# Altium schematic sheet Sheet2.SchDoc
size A4
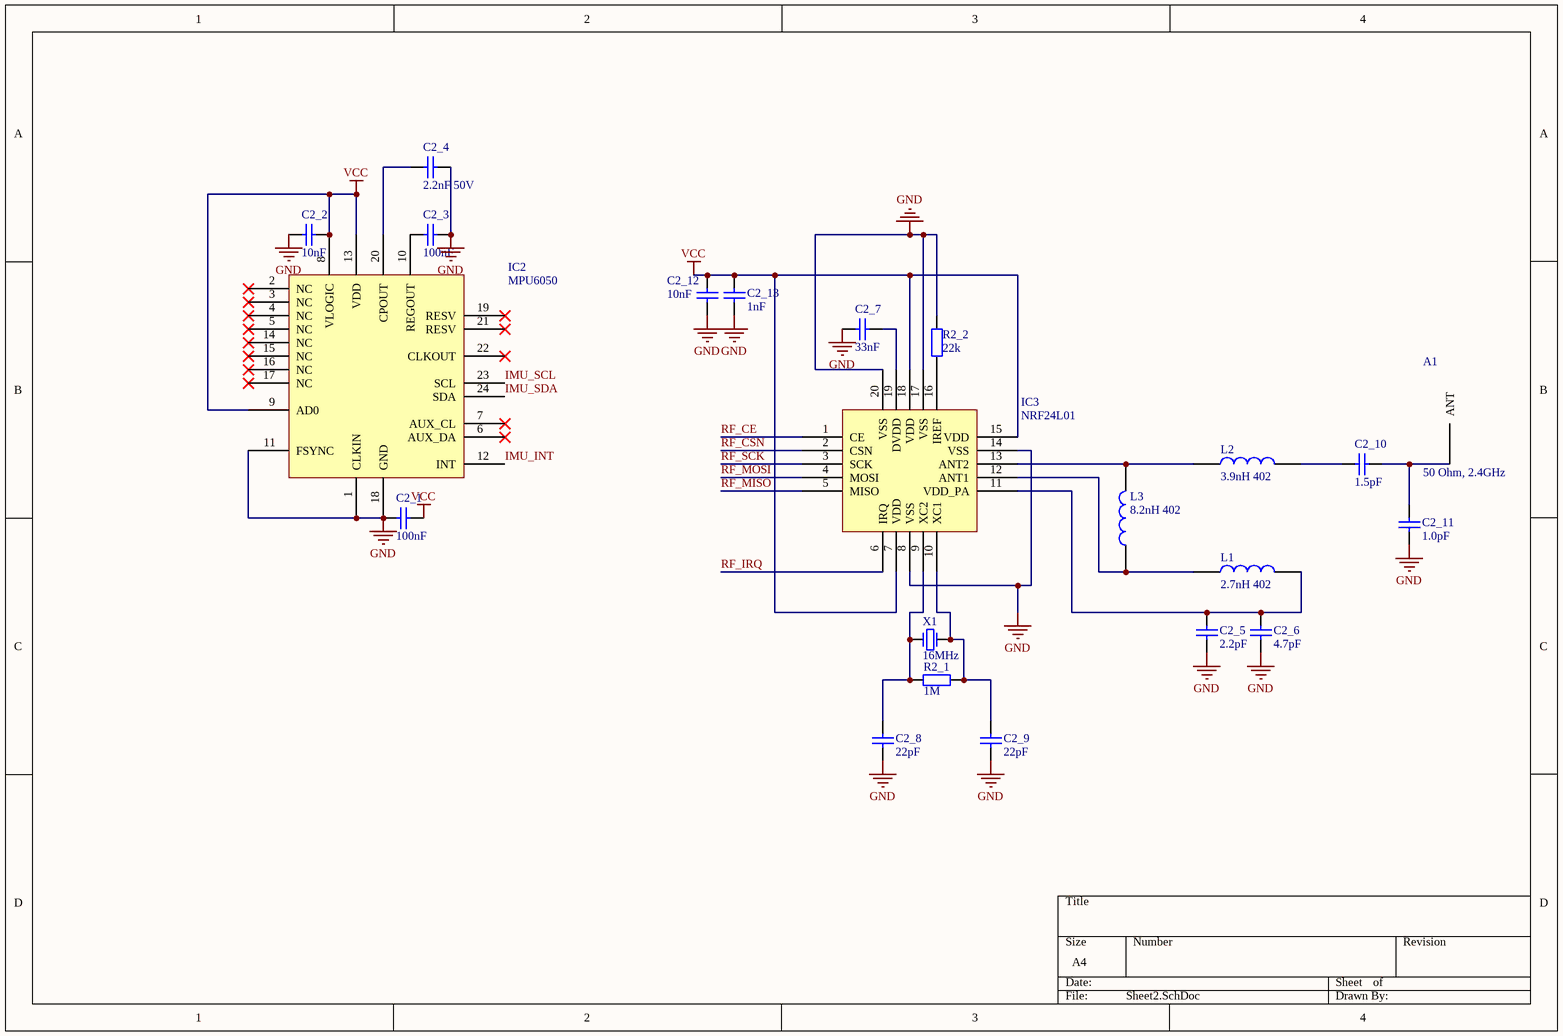
[diagram p0: Sheet2.SchDoc]

## Parts
A1  50 Ohm, 2.4GHz  [Antene]
C2_1  100nF  [cms805]
C2_2  10nF  [cms805]
C2_3  100nF  [cms805]
C2_4  2.2nF 50V  [cms805]
C2_5  2.2pF  [cms805]
C2_6  4.7pF  [cms805]
C2_7  33nF  [cms805]
C2_8  22pF  [cms805]
C2_9  22pF  [cms805]
C2_10  1.5pF  [cms805]
C2_11  1.0pF  [cms805]
C2_12  10nF  [cms805]
C2_13  1nF  [cms805]
IC2  MPU6050  [24QFN]
IC3  NRF24L01  [20QFN]
L1  2.7nH 402  [CMS402]
L2  3.9nH 402  [CMS402]
L3  8.2nH 402  [CMS402]
R2_1  1M  [cms805]
R2_2  22k  [cms805]
X1  16MHz  [Quartz]

## Nets
GND: C2_1.1 C2_2.2 C2_3.2 C2_4.1 C2_5.2 C2_6.2 C2_7.2 C2_8.1 C2_9.1 C2_11.2 C2_12.2 C2_13.2 IC2.1(CLKIN) IC2.11(FSYNC) IC2.18(GND) IC3.8(VSS) IC3.14(VSS) IC3.17(VSS) IC3.20(VSS) R2_2.2
VCC: C2_1.2 C2_2.1 C2_12.1 C2_13.1 IC2.8(VLOGIC) IC2.9(AD0) IC2.13(VDD) IC3.7(VDD) IC3.15(VDD) IC3.18(VDD)
IMU_INT: IC2.12(INT)
IMU_SCL: IC2.23(SCL)
IMU_SDA: IC2.24(SDA)
RF_CE: IC3.1(CE)
RF_CSN: IC3.2(CSN)
RF_IRQ: IC3.6(IRQ)
RF_MISO: IC3.5(MISO)
RF_MOSI: IC3.4(MOSI)
RF_SCK: IC3.3(SCK)
NetA1_1: A1.1(ANT) C2_10.1 C2_11.1
NetC2_3_1: C2_3.1 IC2.10(REGOUT)
NetC2_4_2: C2_4.2 IC2.20(CPOUT)
NetC2_5_1: C2_5.1 C2_6.1 IC3.11(VDD_PA) L1.2
NetC2_7_1: C2_7.1 IC3.19(DVDD)
NetC2_8_2: C2_8.2 IC3.9(XC2) R2_1.1 X1.1
NetC2_9_2: C2_9.2 IC3.10(XC1) R2_1.2 X1.2
NetC2_10_2: C2_10.2 L2.2
NetIC3_12: IC3.12(ANT1) L1.1 L3.1
NetIC3_13: IC3.13(ANT2) L2.1 L3.2
NetIC3_16: IC3.16(IREF) R2_2.1

Not connected (* = marked no-connect by the designer): IC2 2(NC)* 3(NC)* 4(NC)* 5(NC)* 6(AUX_DA)* 7(AUX_CL)* 14(NC)* 15(NC)* 16(NC)* 17(NC)* 19(RESV)* 21(RESV)* 22(CLKOUT)*

## Library data of the parts
A1 = Antenne
C2_1-C2_13 = Capa
L1-L3 = Inductance
R2_1 R2_2 = Resistance
X1 = Quartz